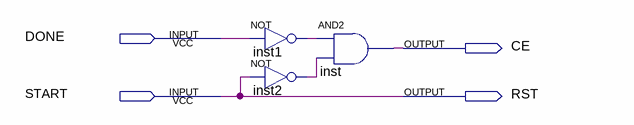
[diagram p0: schematic sheet]
// Quartus schematic ControllerDD.bdf as structural Verilog: 3 symbols, 4 pins
module ControllerDD (
  input  DONE,
  input  START,
  output CE,
  output RST
);

  wire inst1_out, inst2_out;

  not inst1 (inst1_out, DONE);
  not inst2 (inst2_out, START);
  and inst (CE, inst1_out, inst2_out);

  assign RST = START;
endmodule
